# EAGLE design Encoder Board (EAGLE 9.4.0)
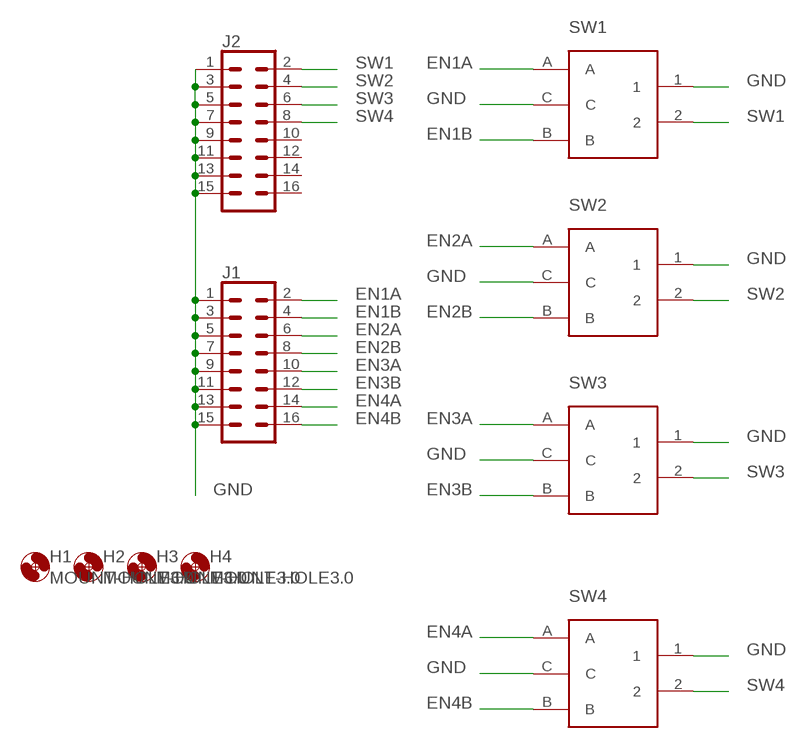
[diagram p0: schematic, sheet 1]

## Parts
H1  MOUNT-HOLE3.0  [3,0]
H2  MOUNT-HOLE3.0  [3,0]
H3  MOUNT-HOLE3.0  [3,0]
H4  MOUNT-HOLE3.0  [3,0]
J1  CONN_08X2  [2X8]
J2  CONN_08X2  [2X8]
SW1  PEC11R-4220F-S0012-ND  [PEC11R-4XXXF-SXXXX]
SW2  PEC11R-4220F-S0012-ND  [PEC11R-4XXXF-SXXXX]
SW3  PEC11R-4220F-S0012-ND  [PEC11R-4XXXF-SXXXX]
SW4  PEC11R-4220F-S0012-ND  [PEC11R-4XXXF-SXXXX]

## Nets
EN1A: J1.2 SW1.A
EN1B: J1.4 SW1.B
EN2A: J1.6 SW2.A
EN2B: J1.8 SW2.B
EN3A: J1.10 SW3.A
EN3B: J1.12 SW3.B
EN4A: J1.14 SW4.A
EN4B: J1.16 SW4.B
GND: J1.1 J1.3 J1.5 J1.7 J1.9 J1.11 J1.13 J1.15 J2.1 J2.3 J2.5 J2.7 J2.9 J2.11 J2.13 J2.15 SW1.1 SW1.C SW2.1 SW2.C SW3.1 SW3.C SW4.1 SW4.C
SW1: J2.2 SW1.2
SW2: J2.4 SW2.2
SW3: J2.6 SW3.2
SW4: J2.8 SW4.2
Unconnected: J2.10 J2.12 J2.14 J2.16

## Library data of the parts
H1-H4 = holes:MOUNT-HOLE: MOUNTING HOLE with drill center marker
J1 J2 = SparkFun-Connectors:CONN_08X2: Multi connection point. Often used as Generic Header-pin footprint for 0.1 inch spaced/style header connections You can populate with any combo of single row headers, but if you'd like an exact match, check this: Header - 2x8 (Male, 0.1") <https://www.sparkfun.com/products/13156> (PRT-13156) On any of the 0.1 inch spaced packages, you can populate with these: Break Away Headers - Straight <https://www.sparkfun.com/products/116> (PRT-00116) Break Away Male Headers - Right Angle <https://www.sparkfun.com/products/553> (PRT-00553) Female Headers <https://www.sparkfun.com/products/115> (PRT-00115) Break Away Headers - Machine Pin <https://www.sparkfun.com/products/117> (PRT-00117) Break Away Female Headers - Swiss Machine Pin <https://www.sparkfun.com/products/743> (PRT-00743)
SW1-SW4 = PersonalLibrary:PEC11R-4220F-S0012-ND

## Board
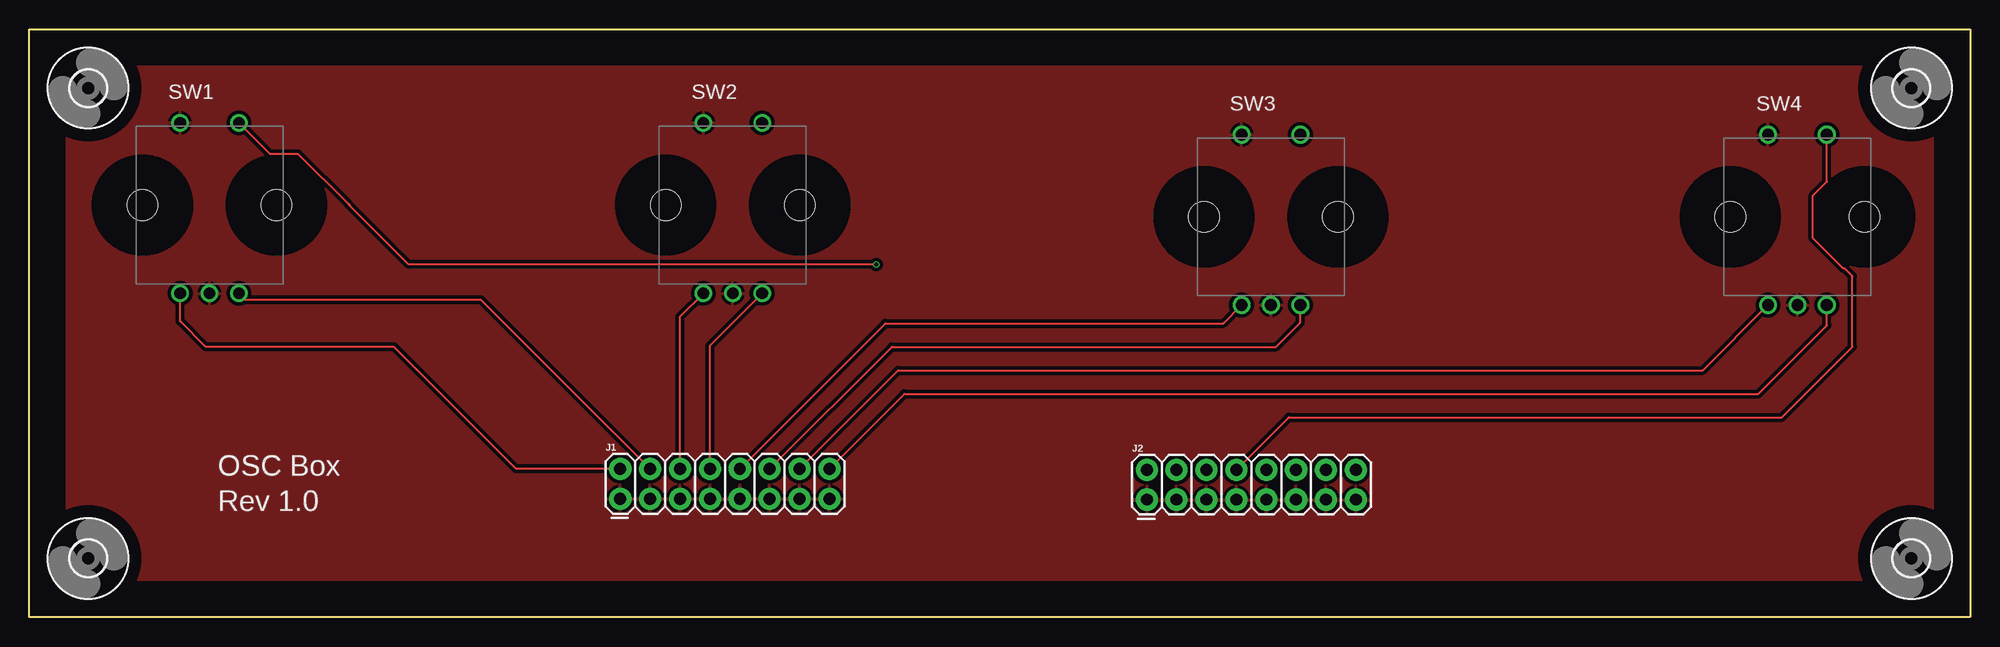
[diagram p1: board, top side]
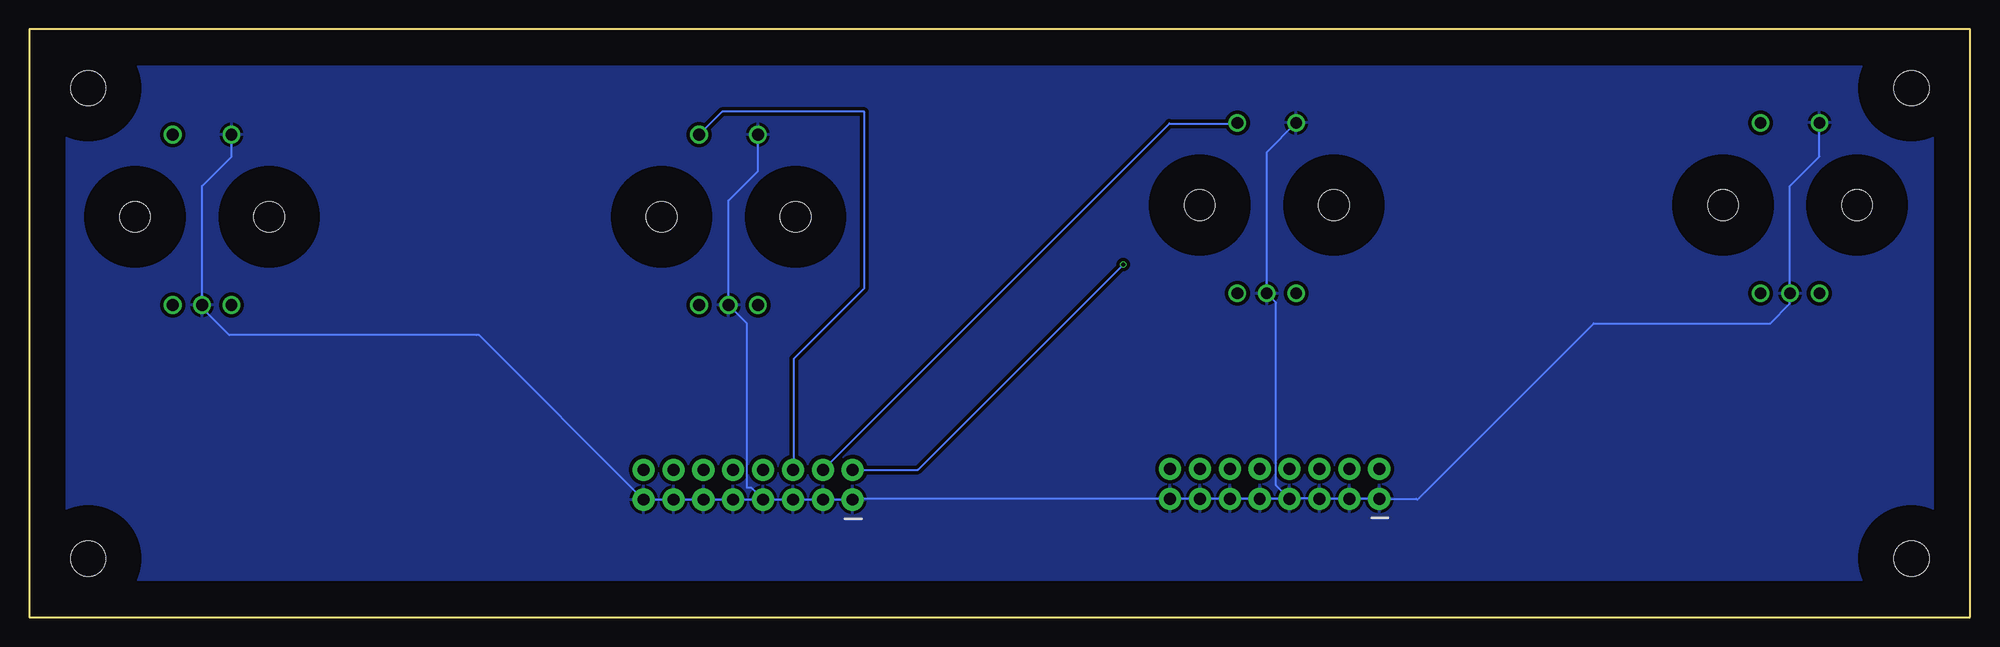
[diagram p2: board, bottom side, seen from below]

Size 165 x 50 mm. Coordinates in mm from the lower left corner, seen from the top.
Outline: 0,0 0,50 165,50 165,0 0,0
Copper layers (1*16): Top 0.035mm / dielectric 1.5mm / Bottom 0.035mm
Design rules "jlcpcb": minimum track width 5mil, minimum drill 0.2mm, track to track 5mil, track to pad 5mil, pad to pad 5mil, via to via 5mil, smd to smd 5mil, copper to edge 3mm, drill to drill 5mil, minimum pad ring 3mil, minimum via ring 3mil, stop-mask expansion 4mil, vias tented up to drill 20mil, thermal gap 10mil

### Footprints (pad centres in the part's own frame; a part is rotated, then mirrored left to right if it is on the bottom)
3,0 = hole 3: 0,0
2X8 = drill 1.016 pad 1.88: 1 0,0; 2 0,2.54; 3 2.54,0; 4 2.54,2.54; 5 5.08,0; 6 5.08,2.54; 7 7.62,0; 8 7.62,2.54; 9 10.16,0; 10 10.16,2.54; 11 12.7,0; 12 12.7,2.54; 13 15.24,0; 14 15.24,2.54; 15 17.78,0; 16 17.78,2.54
PEC11R-4XXXF-SXXXX = drill 1: 1 -2.5,7; 2 2.5,7; A -2.5,-7.5; B 2.5,-7.5; C 0,-7.5 | hole 2.6: 5.7,0; -5.7,0

### Placement (x,y rotation side)
H1  160,5 0 top
H2  5,5 0 top
H3  5,45 0 top
H4  160,45 0 top
J1  50.24,10.08 0 top
J2  95,10 0 top
SW1  15.31,35.05 0 top
SW2  59.8,35.05 0 top
SW3  105.56,34.05 0 top
SW4  150.32,34.05 0 top

### Tracks (layer width: path | path; a pad name or v marks a point on that pad's centre or on a via)
EN1A
  Top 0.152: J1.2 41.38,12.62 31,23 15,23 12.81,25.19 SW1.A
EN1B
  Top 0.152: J1.4 38.4,27 18.36,27 SW1.B
EN2A
  Top 0.152: J1.6 55.32,25.57 SW2.A
EN2B
  Top 0.152: J1.8 57.86,23.11 SW2.B
EN3A
  Top 0.152: J1.10 72.78,25 101.51,25 SW3.A
EN3B
  Top 0.152: J1.12 73.32,23 106,23 108.06,25.06 SW3.B
EN4A
  Top 0.152: J1.14 73.86,21 142.27,21 SW4.A
EN4B
  Top 0.152: J1.16 74.4,19 147,19 152.82,24.82 SW4.B
GND
  Bottom 0.152: SW1.1 12.81,39.19 15.31,36.69 SW1.C 15.31,26.69 17,25 32,25 47,10 47.08,10.08 J1.1 J1.3 J1.5 55.35,10.11 57.89,10.11 | 57.89,10.11 J1.7 J1.9 J1.11 J1.13 | 57.89,10.11 59,11.22 59,13.09 59,13.1 59,26.75 SW2.C 59.8,39.55 SW2.1 | J2.7 103.62,11 104,11 104,24.99 SW3.C 105.56,35.44 103.06,37.94 SW3.1 | SW4.1 147.82,39.18 150.32,36.68 SW4.C 150.32,26.32 148,24 127,24 126.78,24 J2.15 J2.13 J2.11 J2.9 J2.7 | J1.13 65.92,10.08 66,10 65.56,10 J1.13 | J1.13 J1.15 94.92,10.08 J2.1 J2.3 J2.5 J2.7
  pour Top (isolate 0.305): 0,50 165,50 165,0 0,0
  pour Bottom (isolate 0.305): 0,50 165,50 165,0 0,0
SW1  (via drill 0.35)
  Top 0.152: SW1.2 20.43,39.43 22.82,39.43 27.12,35.12 27.25,35 32.25,30 v72,30
  Bottom 0.152: J2.2 89.46,12.54 v72,30
SW2
  Bottom 0.152: J2.4 68.08,42 62.35,42 SW2.2
SW3
  Bottom 0.152: J2.6 100,12.62 100,22 94,28 94,43 106.11,43 SW3.2
SW4
  Top 0.152: J2.8 107.08,17 149,17 155,23 155,29 154.33,29.67 154.21,29.67 151.64,32.24 151.64,35.86 152.82,37.04 SW4.2

### Text on the board
tPlace: OSC Box | Rev 1.0